# Altium schematic sheet RaspberryPinout.SchDoc: Okosotthon vezérlő HAT
size A4; Author: Bencsik Dániel Zoltán; Organization: BME VIK AUT; DocumentNumber: 2; SheetNumber: 2; SheetTotal: 4
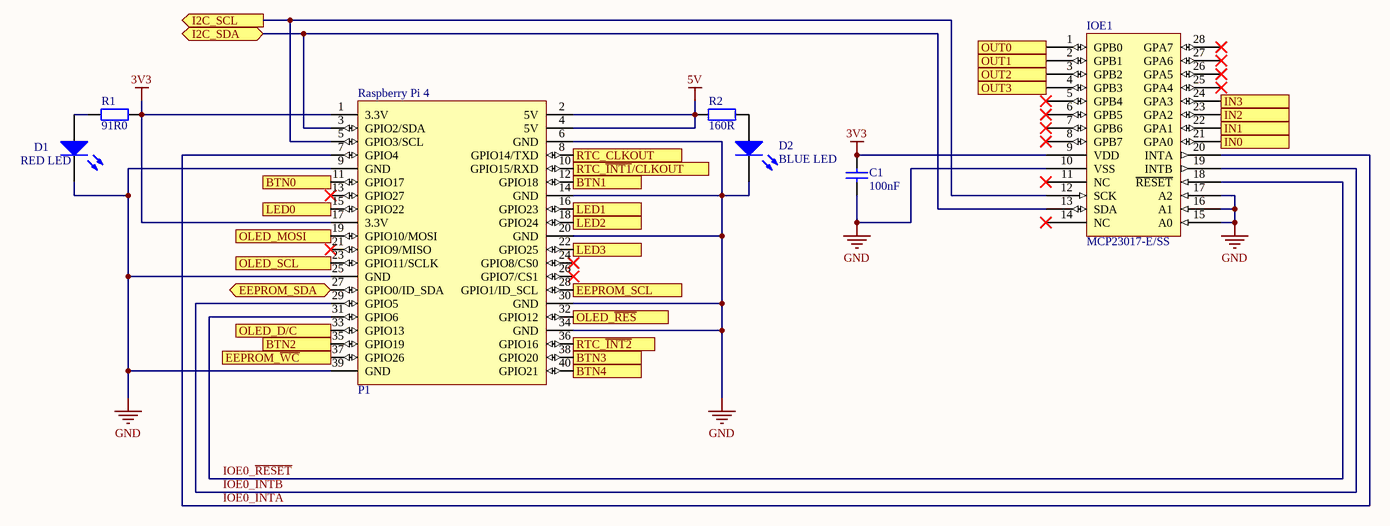
[diagram p0: RaspberryPinout.SchDoc]

## Parts
C1  100nF  [FP_0805_CAP_085]
D1  RED LED  [FP_0805_LED_RED]
D2  BLUE LED  [FP_0805_LED_BLUE]
IOE1  MCP23017-E/SS  [ONLAB_MCP23017-E/SS_SOP65P780X200-28N]
P1  Raspberry Pi 4  [ONLAB_RASPBERRY_4_BIG]
R1  91R0  [FP_0805_RES]
R2  160R  [FP_0805_RES]

## Ports
BTN0 (in), BTN1 (in), BTN2 (in), BTN3 (in), BTN4 (in), EEPROM_SCL (out), EEPROM_SDA (bidir), EEPROM_~{WC} (out), I2C_SCL (out), I2C_SDA (bidir), IN0 (in), IN1 (in), IN2 (in), IN3 (in), LED0 (out), LED1 (out), LED2 (out), LED3 (out), OLED_D/C (out), OLED_MOSI (out), OLED_SCL (out), OLED_~{RES} (out), OUT0 (out), OUT1 (out), OUT2 (out), OUT3 (out), RTC_CLKOUT (in), RTC_~{INT1}/CLKOUT (in), RTC_~{INT2} (in)

## Nets
3V3: C1.2 IOE1.9(VDD) P1.1(3.3V) P1.17(3.3V) R1.2
5V: P1.2(5V) P1.4(5V) R2.1
GND: C1.1 D1.K D2.K IOE1.10(VSS) IOE1.15(A0) IOE1.16(A1) IOE1.17(A2) P1.6(GND) P1.9(GND) P1.14(GND) P1.20(GND) P1.25(GND) P1.30(GND) P1.34(GND) P1.39(GND)
BTN0: P1.11(GPIO17) ; port BTN0
BTN1: P1.12(GPIO18) ; port BTN1
BTN2: P1.35(GPIO19) ; port BTN2
BTN3: P1.38(GPIO20) ; port BTN3
BTN4: P1.40(GPIO21) ; port BTN4
EEPROM_SCL: P1.28(GPIO1/ID_SCL) ; port EEPROM_SCL
EEPROM_SDA: P1.27(GPIO0/ID_SDA) ; port EEPROM_SDA
EEPROM_~{WC}: P1.37(GPIO26) ; port EEPROM_~{WC}
I2C_SCL: IOE1.12(SCK) P1.5(GPIO3/SCL) ; port I2C_SCL
I2C_SDA: IOE1.13(SDA) P1.3(GPIO2/SDA) ; port I2C_SDA
IN0: IOE1.21(GPA0) ; port IN0
IN1: IOE1.22(GPA1) ; port IN1
IN2: IOE1.23(GPA2) ; port IN2
IN3: IOE1.24(GPA3) ; port IN3
IOE0_INTA: IOE1.20(INTA) P1.7(GPIO4)
IOE0_INTB: IOE1.19(INTB) P1.29(GPIO5)
IOE0_~{RESET}: IOE1.18(~{RESET}) P1.31(GPIO6)
LED0: P1.15(GPIO22) ; port LED0
LED1: P1.16(GPIO23) ; port LED1
LED2: P1.18(GPIO24) ; port LED2
LED3: P1.22(GPIO25) ; port LED3
OLED_D/C: P1.33(GPIO13) ; port OLED_D/C
OLED_MOSI: P1.19(GPIO10/MOSI) ; port OLED_MOSI
OLED_~{RES}: P1.32(GPIO12) ; port OLED_~{RES}
OLED_SCL: P1.23(GPIO11/SCLK) ; port OLED_SCL
OUT0: IOE1.1(GPB0) ; port OUT0
OUT1: IOE1.2(GPB1) ; port OUT1
OUT2: IOE1.3(GPB2) ; port OUT2
OUT3: IOE1.4(GPB3) ; port OUT3
RTC_CLKOUT: P1.8(GPIO14/TXD) ; port RTC_CLKOUT
RTC_~{INT1}/CLKOUT: P1.10(GPIO15/RXD) ; port RTC_~{INT1}/CLKOUT
RTC_~{INT2}: P1.36(GPIO16) ; port RTC_~{INT2}
NetD1_A: D1.A R1.1
NetD2_A: D2.A R2.2

Not connected (* = marked no-connect by the designer): IOE1 5(GPB4)* 6(GPB5)* 7(GPB6)* 8(GPB7)* 11(NC)* 14(NC)* 25(GPA4)* 26(GPA5)* 27(GPA6)* 28(GPA7)*; P1 13(GPIO27)* 21(GPIO9/MISO)* 24(GPIO8/CS0)* 26(GPIO7/CS1)*

## Notes on the sheet
- Title
- Size:
- Date:
- A4
- Number:
- Time:
- Revision:
- Sheet
- of
- File:

## Library data of the parts
C1 = CAP: Capacitor; Value: 100nF
D1 D2 = LED: Typical RED GaAs LED
IOE1 = MCP23017-E/SS: I/O Expander, 16bit, 1.7 MHz, I2C, Serial, 4.5 V, 5.5 V, SSOP
R1 R2 = RES: Resistor
  R1: Value: 91R0
  R2: Value: 160R